# EasyEDA Pro project FPGC-CycloneIV-AIO.eprj, schematic Schematic1, sheets 1 to 3 of 4

## Sheets
1 FPGA: Board Name: Board1; Create Date: 2025-10-27; Page Name: FPGA; Project Name: FPGC-CycloneIV-AIO; Schematic Name: Schematic1; Update Date: 2025-11-22; Company: EasyEDA.com; Page Size: A4; Version: V1.0
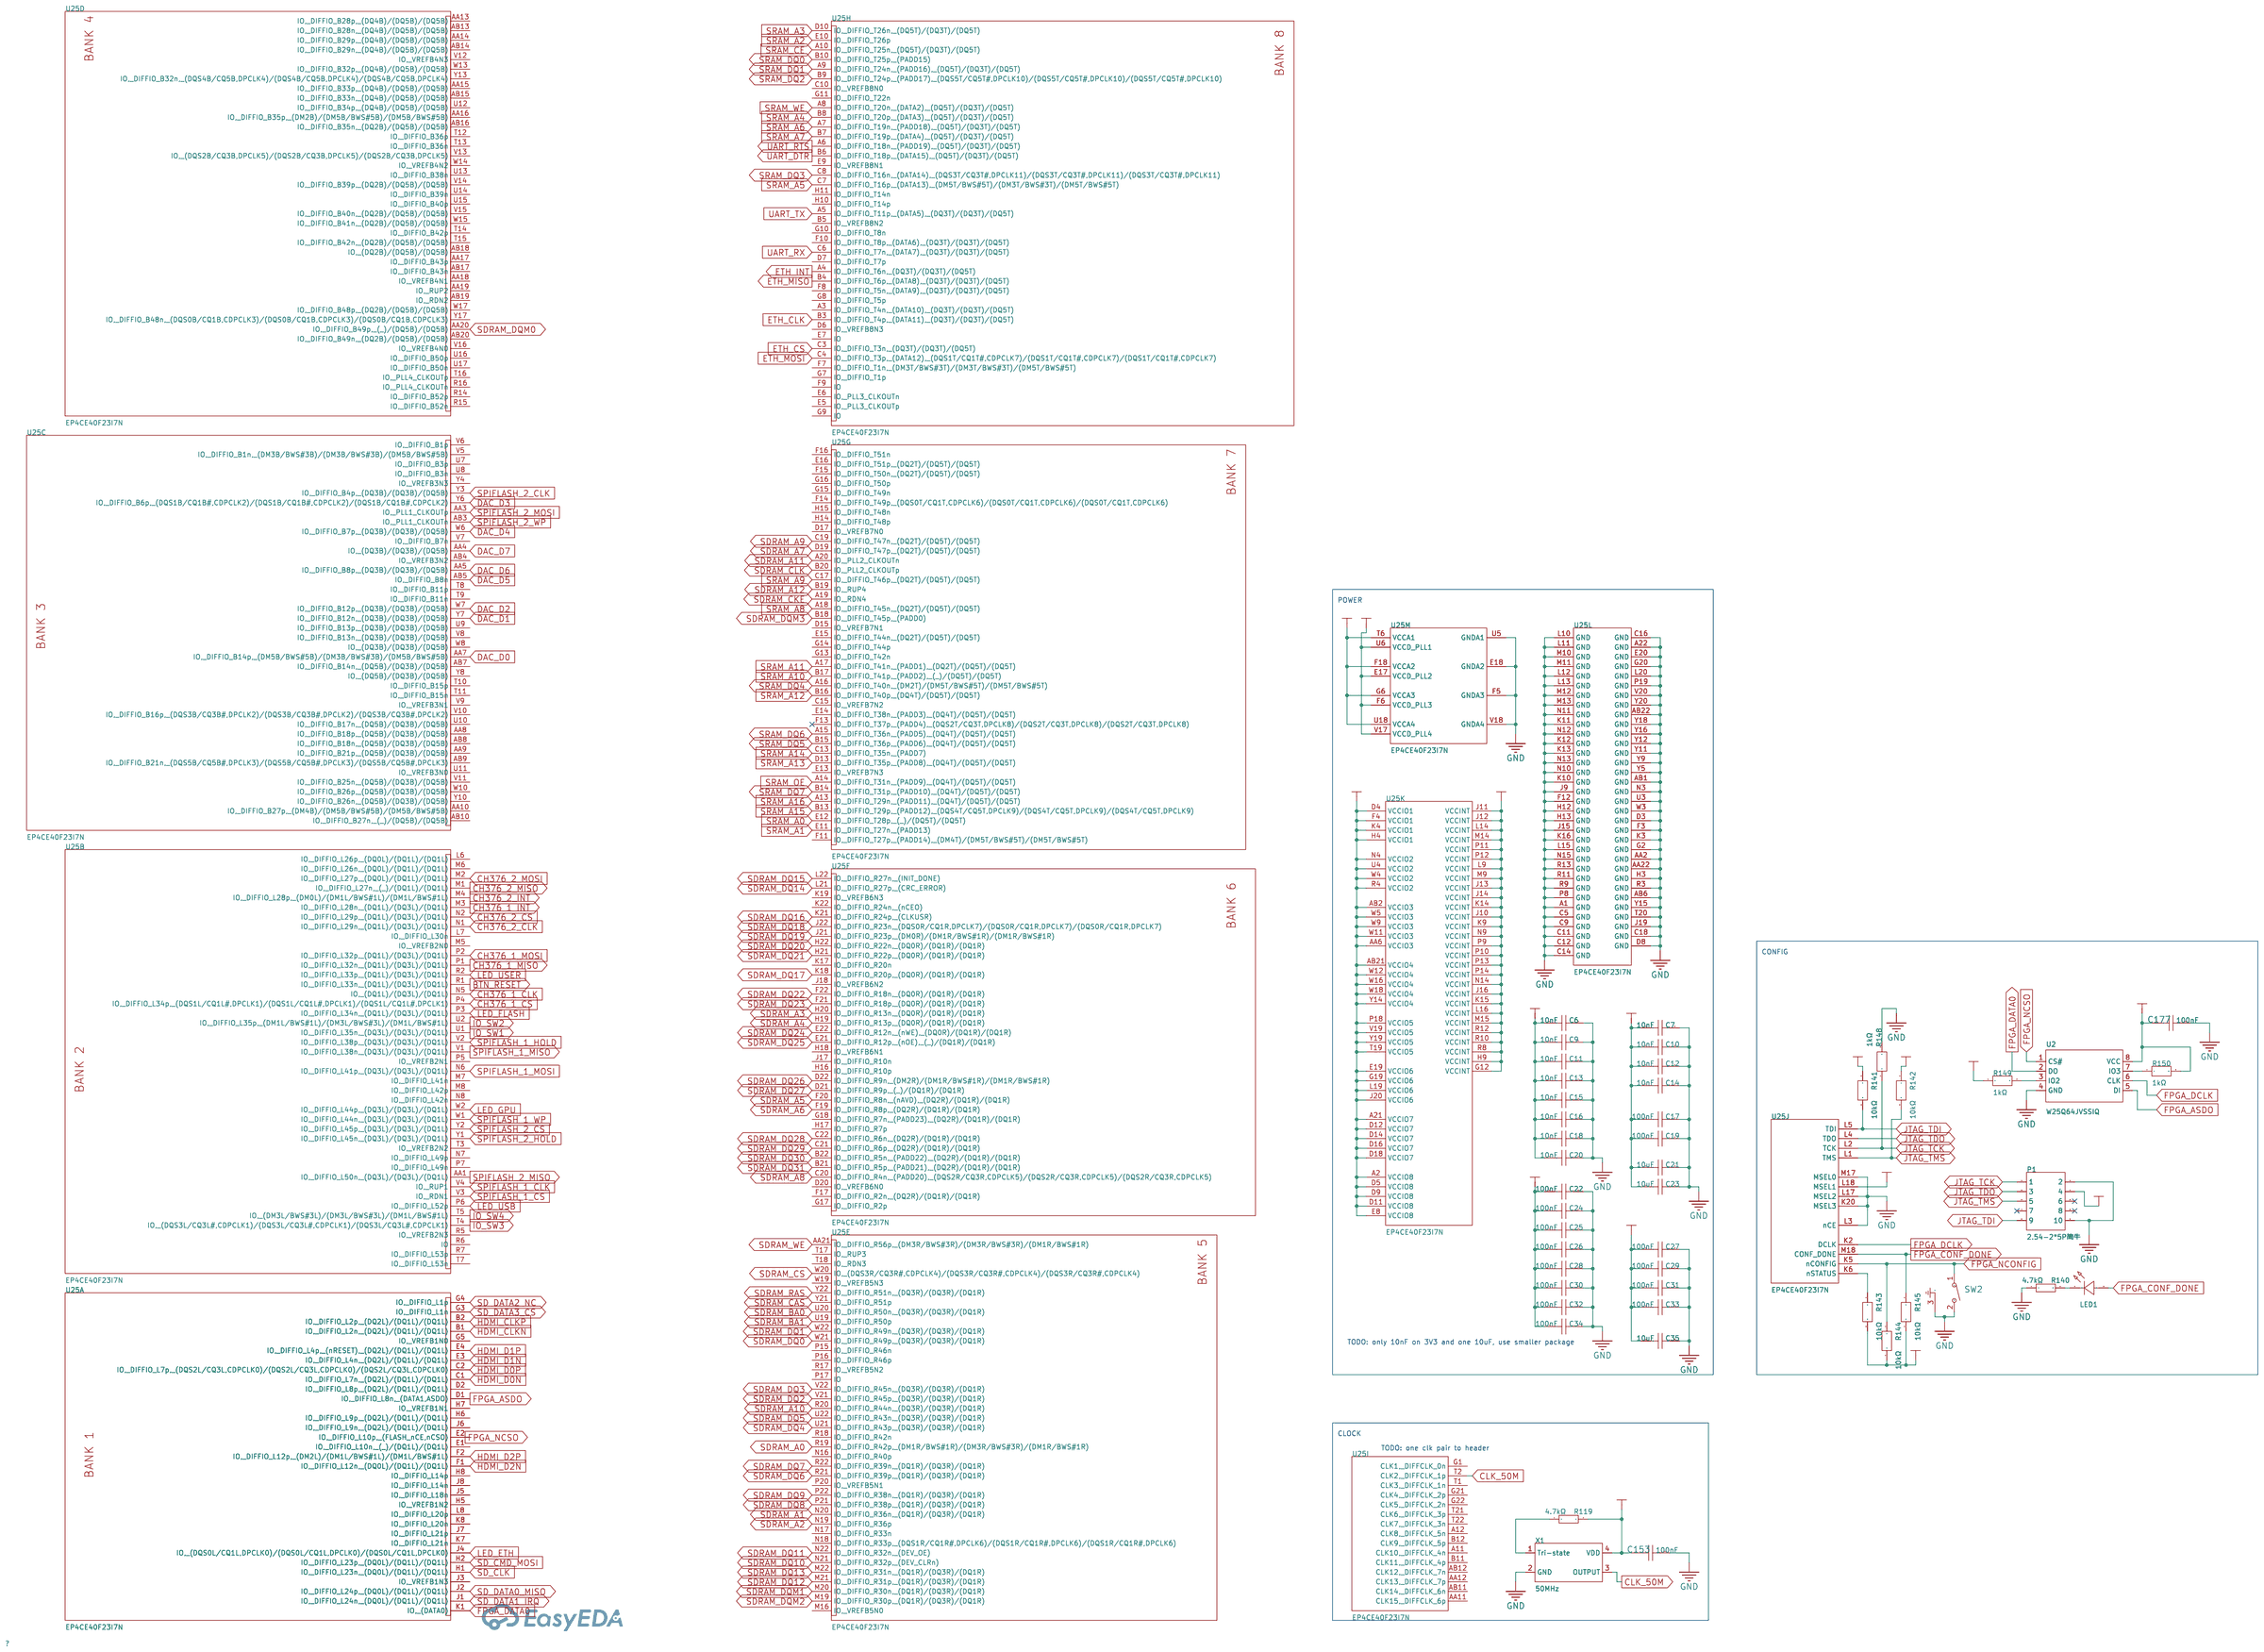
[diagram p0: FPGA]
2 Power: Create Date: 2025-10-28; Page Name: Power; Update Date: 2025-11-03
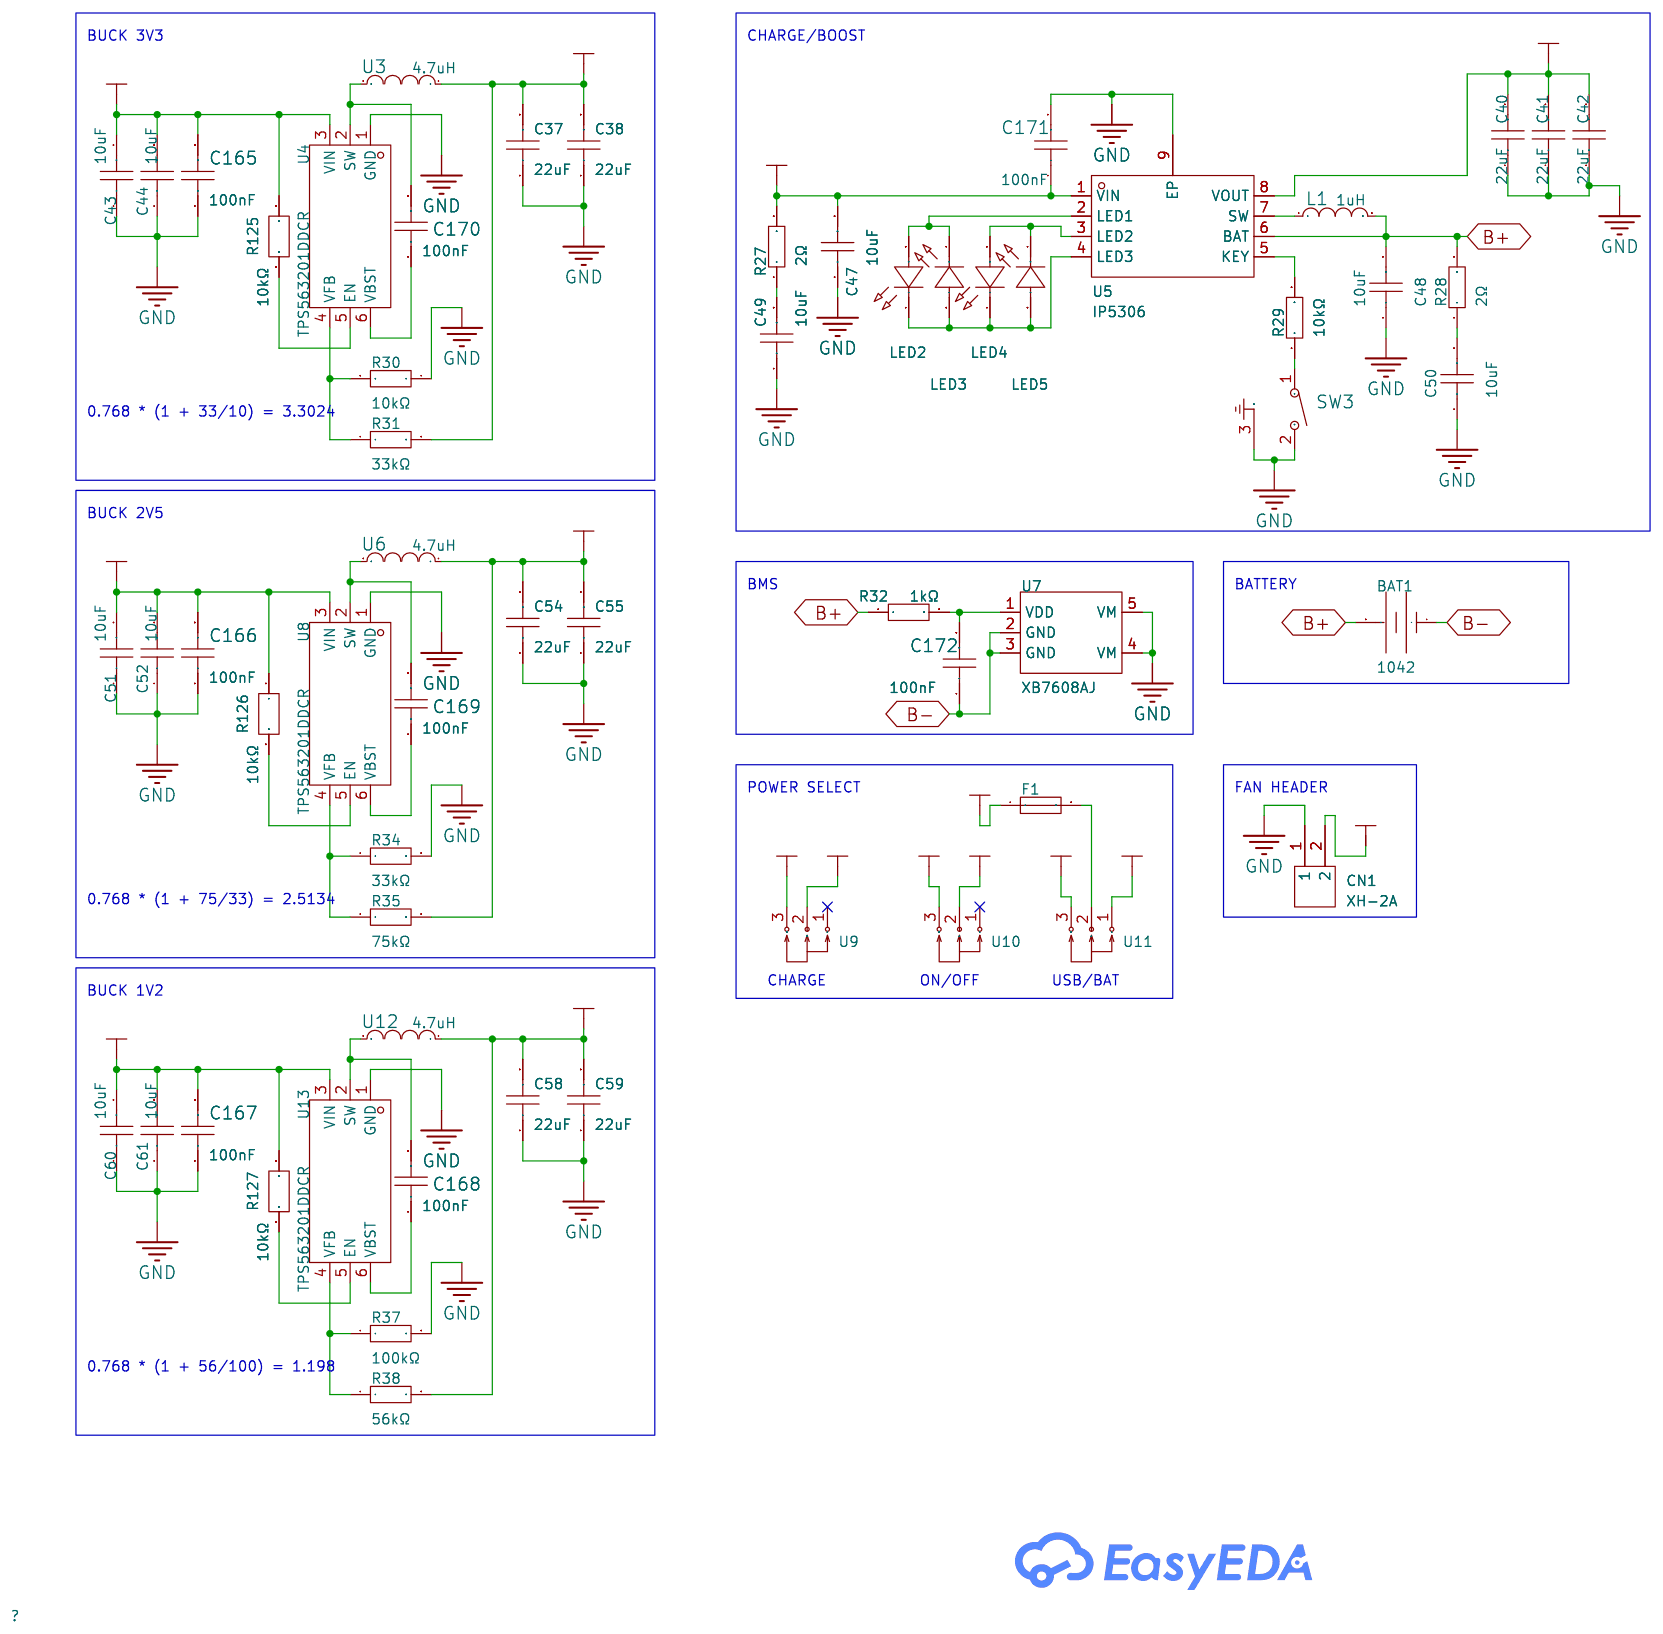
[diagram p1: Power]
3 RAM: Create Date: 2025-10-28; Page Name: RAM; Update Date: 2025-11-15
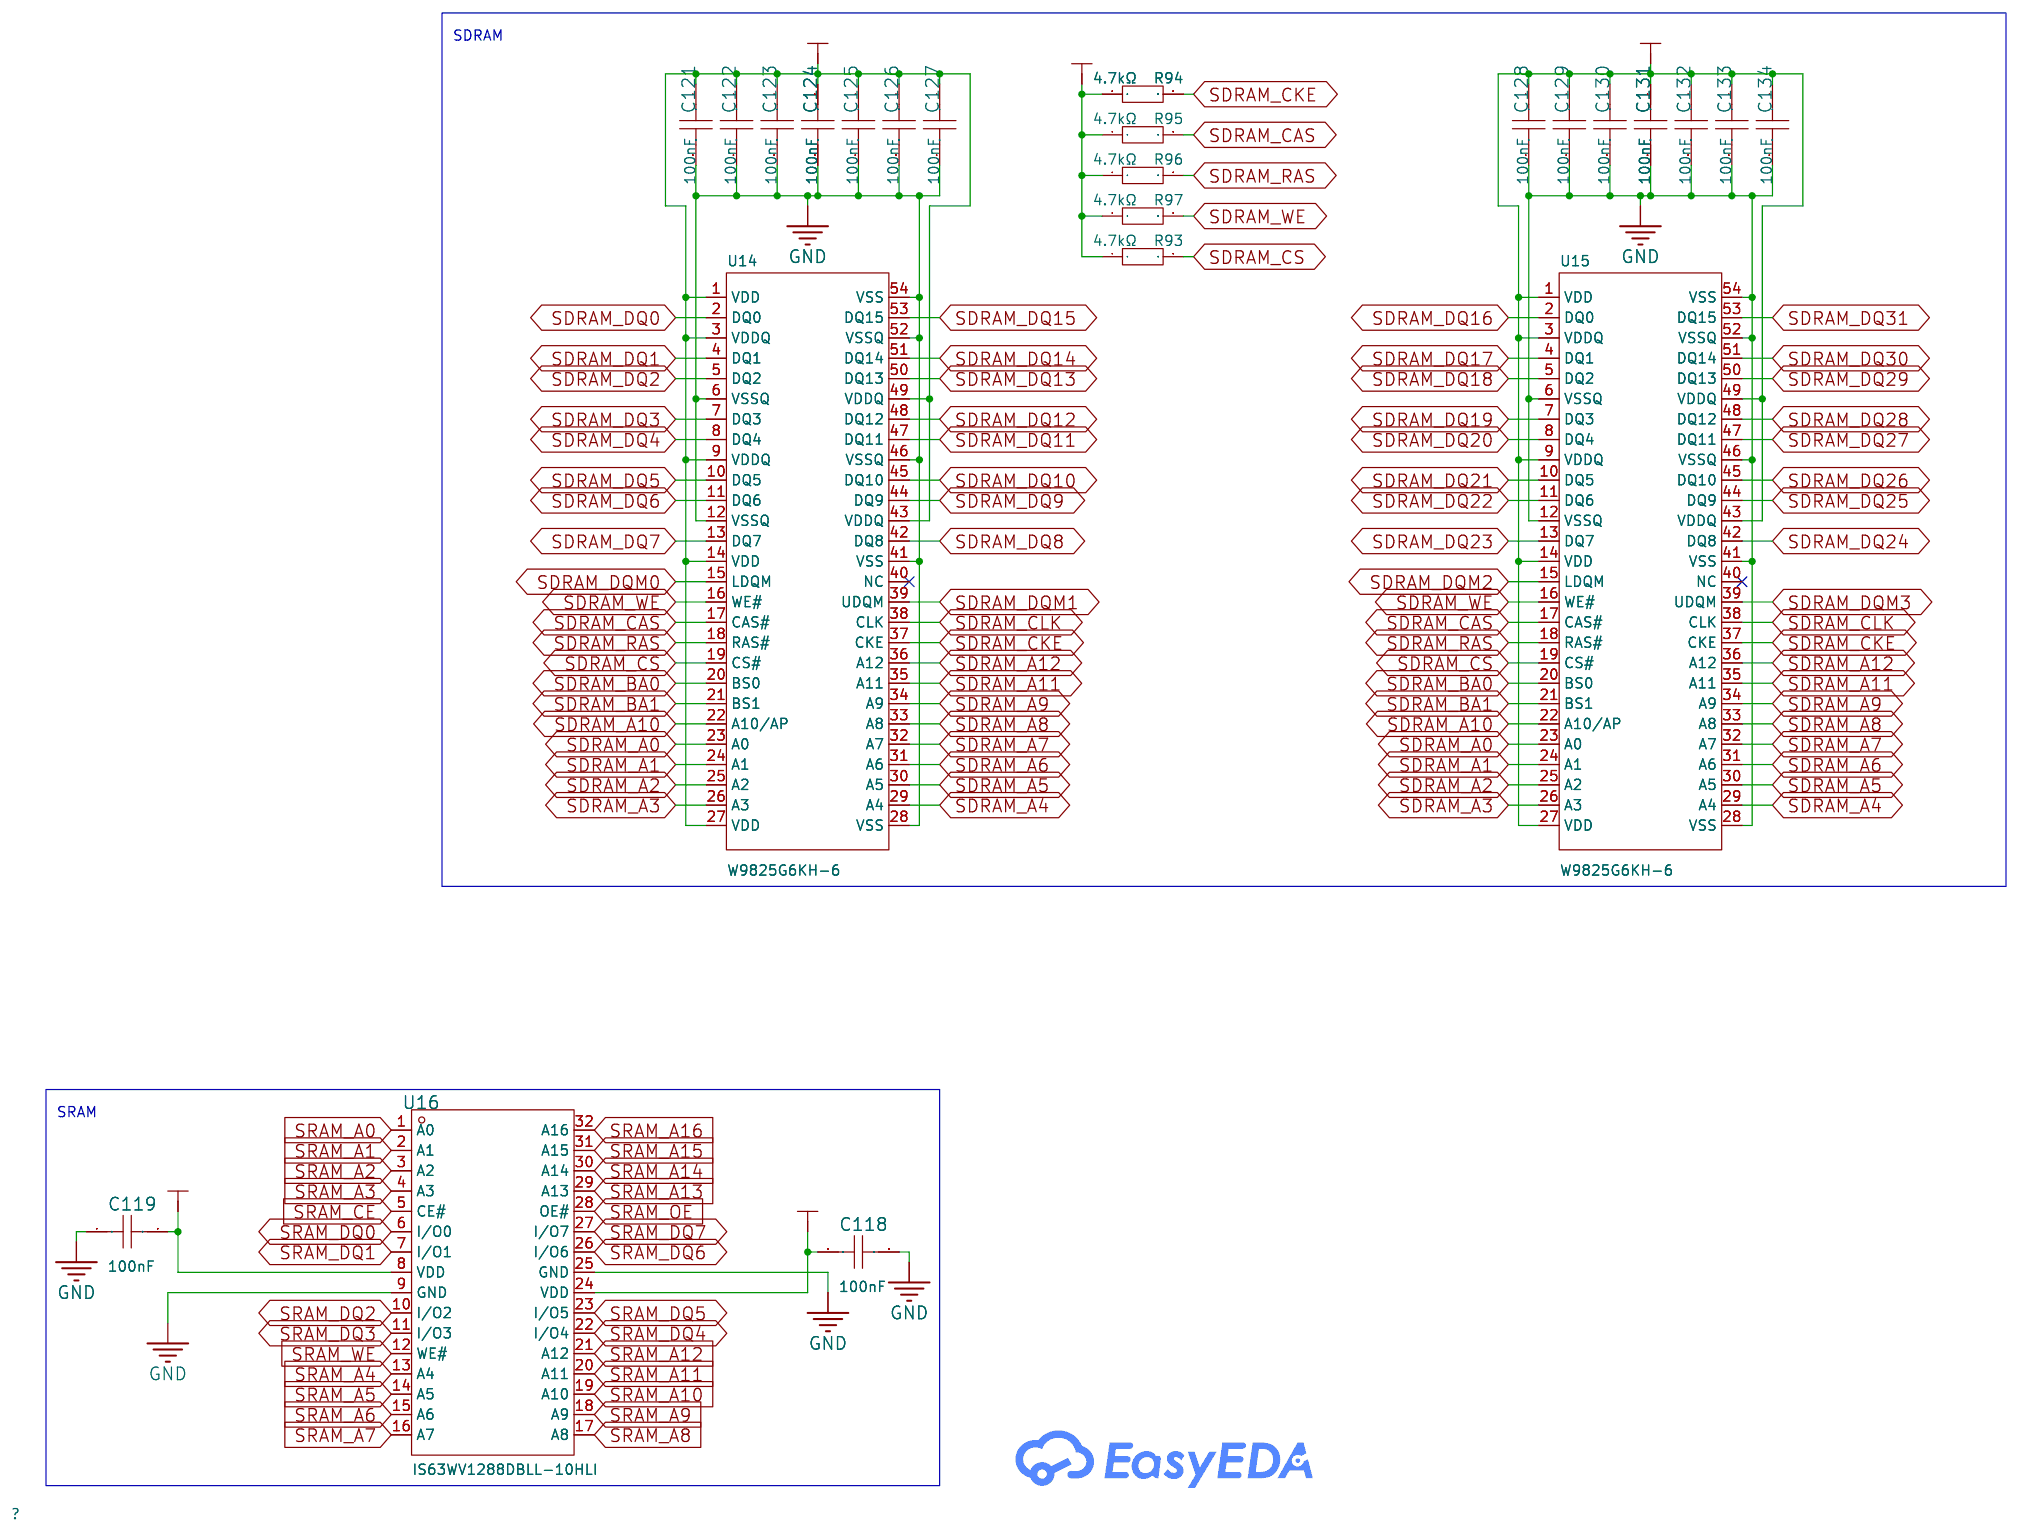
[diagram p2: RAM]

## Parts
sheet FPGA
C6  10nF  [C0805]
C7  10nF  [C0805]
C9  10nF  [C0805]
C10  10nF  [C0805]
C11  10nF  [C0805]
C12  10nF  [C0805]
C13  10nF  [C0805]
C14  10nF  [C0805]
C15  10nF  [C0805]
C16  10nF  [C0805]
C17  100nF  [C0805]
C18  10nF  [C0805]
C19  100nF  [C0805]
C20  10nF  [C0805]
C21  10uF  [C0805]
C22  100nF  [C0805]
C23  10uF  [C0805]
C24  100nF  [C0805]
C25  100nF  [C0805]
C26  100nF  [C0805]
C27  100nF  [C0805]
C28  100nF  [C0805]
C29  100nF  [C0805]
C30  100nF  [C0805]
C31  100nF  [C0805]
C32  100nF  [C0805]
C33  100nF  [C0805]
C34  100nF  [C0805]
C35  10uF  [C0805]
C153  100nF  [C0603]
C177  100nF  [C0603]
LED1  XL-2012SURC  [LED0805-RD_RED]
P1  2.54-2*5P简牛  [IDC-TH_10P-P2.54_C5665]
R119  4.7kΩ  [R0603]
R140  4.7kΩ  [R0603]
R141  10kΩ  [R0603]
R142  10kΩ  [R0603]
R143  10kΩ  [R0603]
R144  10kΩ  [R0603]
R145  10kΩ  [R0603]
R148  1kΩ  [R0603]
R149  1kΩ  [R0603]
R150  1kΩ  [R0603]
SW2  TS-1009B-05026  [SW-TH_3P-L4.5-W3.8-P3.10-LS1.9]
U2  W25Q64JVSSIQ  [SOP-8_L5.3-W5.3-P1.27-LS8.0-BL]
U25  EP4CE40F23I7N  [FBGA-484_L23.0-W23.0-R22-C22-P1.00-TL]  (sections 1,10,11,12,13,2,3,4,5,6,7,8,9)
X1  50MHz  [OSC-SMD_4P-L3.2-W2.5-BL]
sheet Power
BAT1  1042  [BAT-SMD_1042P]
C37  22uF  [C0805]
C38  22uF  [C0805]
C40  22uF  [C0805]
C41  22uF  [C0805]
C42  22uF  [C0805]
C43  10uF  [C0805]
C44  10uF  [C0805]
C47  10uF  [C0805]
C48  10uF  [C0805]
C49  10uF  [C0805]
C50  10uF  [C0805]
C51  10uF  [C0805]
C52  10uF  [C0805]
C54  22uF  [C0805]
C55  22uF  [C0805]
C58  22uF  [C0805]
C59  22uF  [C0805]
C60  10uF  [C0805]
C61  10uF  [C0805]
C165  100nF  [C0603]
C166  100nF  [C0603]
C167  100nF  [C0603]
C168  100nF  [C0603]
C169  100nF  [C0603]
C170  100nF  [C0603]
C171  100nF  [C0603]
C172  100nF  [C0603]
CN1  XH-2A  [CONN-TH_XH-2A]
F1  MF-MSMF110/16-2  [F1812]
L1  1uH  [IND-SMD_L7.2-W6.6_GPSR0730]
LED2  XL-2012SURC  [LED0805-RD_RED]
LED3  XL-2012SURC  [LED0805-RD_RED]
LED4  XL-2012SURC  [LED0805-RD_RED]
LED5  XL-2012SURC  [LED0805-RD_RED]
R27  2Ω  [R0805]
R28  2Ω  [R0805]
R29  10kΩ  [R0805]
R30  10kΩ  [R0805]
R31  33kΩ  [R0805]
R32  1kΩ  [R0805]
R34  33kΩ  [R0805]
R35  75kΩ  [R0805]
R37  100kΩ  [R0805]
R38  56kΩ  [R0805]
R125  10kΩ  [R0603]
R126  10kΩ  [R0603]
R127  10kΩ  [R0603]
SW3  TS-1009B-05026  [SW-TH_3P-L4.5-W3.8-P3.10-LS1.9]
U3  4.7uH  [IND-SMD_L7.2-W6.6_GPSR07X0]
U4  TPS563201DDCR  [SOT-23-6_L2.9-W1.6-P0.95-LS2.8-BR]
U5  IP5306  [ESOP-8_L4.9-W3.9-P1.27-LS6.0-BL-EP]
U6  4.7uH  [IND-SMD_L7.2-W6.6_GPSR07X0]
U7  XB7608AJ  [CPC-5_L2.6-W2.6-P0.53-LS4.0-BL]
U8  TPS563201DDCR  [SOT-23-6_L2.9-W1.6-P0.95-LS2.8-BR]
U9  SS12D10G6-WJ  [SW-TH_3P-P4.80_HX-SS12D10G6-WJ]
U10  SS12D10G6-WJ  [SW-TH_3P-P4.80_HX-SS12D10G6-WJ]
U11  SS12D10G6-WJ  [SW-TH_3P-P4.80_HX-SS12D10G6-WJ]
U12  4.7uH  [IND-SMD_L7.2-W6.6_GPSR07X0]
U13  TPS563201DDCR  [SOT-23-6_L2.9-W1.6-P0.95-LS2.8-BR]
sheet RAM
C118  100nF  [C0603]
C119  100nF  [C0603]
C121  100nF  [C0603]
C122  100nF  [C0603]
C123  100nF  [C0603]
C124  100nF  [C0603]
C125  100nF  [C0603]
C126  100nF  [C0603]
C127  100nF  [C0603]
C128  100nF  [C0603]
C129  100nF  [C0603]
C130  100nF  [C0603]
C131  100nF  [C0603]
C132  100nF  [C0603]
C133  100nF  [C0603]
C134  100nF  [C0603]
R93  4.7kΩ  [R0603]
R94  4.7kΩ  [R0603]
R95  4.7kΩ  [R0603]
R96  4.7kΩ  [R0603]
R97  4.7kΩ  [R0603]
U14  W9825G6KH-6  [TSOP-54_L22.2-W10.2-P0.80-LS11.8-BL]
U15  W9825G6KH-6  [TSOP-54_L22.2-W10.2-P0.80-LS11.8-BL]
U16  IS63WV1288DBLL-10HLI  [TSOPI-32_L18.4-W8.0-P0.50-LS20.0-TL]

## Library data of the parts
C6 C7 C9-C16 C18 C20 = CC0805KRX7R9BB103: LCSC Part Name: 10nF ±10% 50V; Supplier Part: C83170; Manufacturer: YAGEO(国巨); Supplier Footprint: 0805; JLCPCB Part Class: Extended Part; Datasheet: https://item.szlcsc.com/datasheet/CC0805KRX7R9BB103/84334.html; Supplier: LCSC; Tolerance: ±10%; Voltage Rating: 50V; Temperature Coefficient: X7R
C17 C19 C22 C24-C34 = CC0805KRX7R9BB104: LCSC Part Name: 100nF ±10% 50V; Supplier Part: C49678; Manufacturer: YAGEO(国巨); Supplier Footprint: 0805; JLCPCB Part Class: Basic Part; Datasheet: https://item.szlcsc.com/datasheet/CC0805KRX7R9BB104/50686.html; Supplier: LCSC; Tolerance: ±10%; Voltage Rating: 50V; Temperature Coefficient: X7R
C21 C23 C35 C43 C44 C47-C52 C60 C61 = CL21A106KAYNNNE_C15850: LCSC Part Name: 10uF ±10% 25V; Supplier Part: C15850; Manufacturer: SAMSUNG(三星); Manufacturer Part: CL21A106KAYNNNE; Supplier Footprint: 0805; JLCPCB Part Class: Basic Part; Datasheet: https://item.szlcsc.com/datasheet/CL21A106KAYNNNE/16532.html; Supplier: LCSC; Tolerance: ±10%; Voltage Rating: 25V; Temperature Coefficient: X5R
C118 C119 C121-C134 C153 C165-C172 C177 = CL10B104KB8NNNC: LCSC Part Name: 100nF ±10% 50V; Supplier Part: C1591; Manufacturer: SAMSUNG(三星); Supplier Footprint: 0603; JLCPCB Part Class: Extended Part; Datasheet: https://item.szlcsc.com/datasheet/CL10B104KB8NNNC/1943.html; Supplier: LCSC; Tolerance: ±10%; Voltage Rating: 50V; Temperature Coefficient: X7R
LED1-LED5 = XL-2012SURC: Supplier Part: C965812; Manufacturer: XINGLIGHT(成兴光); Supplier Footprint: 0805; JLCPCB Part Class: Extended Part; Datasheet: https://atta.szlcsc.com/upload/public/pdf/source/20221102/49E1A0A365644091E6270AF1C5E0FE37.pdf; Supplier: LCSC; Emitted Color: Red; Power Dissipation: 55mW; Forward Current: 25mA; Dominant Wavelength: 617nm~621nm; Peak Wavelength: 623nm; Lens Color: 无色透明透镜; Viewing Angle: 120°; Mounting Sytle: Positive post; Operating Temperature: -30℃~+85℃
P1 = 2.54-2*5P简牛: LCSC Part Name: 2.54mm 2x5P 排数:2 每排P数:5; Supplier Part: C5665; Manufacturer: BOOMELE(博穆精密); Supplier Footprint: 插件,P=2.54mm; JLCPCB Part Class: Extended Part; Datasheet: https://item.szlcsc.com/datasheet/2.54-2*5P%25E7%25AE%2580%25E7%2589%259B/6118.html; Supplier: LCSC; Connector Type: IDC Header; Pitch: 2.54mm; Number of Positions or Pins: 2x5P; Holder Type: Through Hole; Row Spacing: 2.54mm; Number of Rows: 2; Number of PINs Per Row: 5
R93-R97 R119 R140 = RC0603FR-074K7L: LCSC Part Name: 厚膜电阻 4.7kΩ ±1% 100mW; Supplier Part: C99782; Manufacturer: YAGEO(国巨); Supplier Footprint: 0603; JLCPCB Part Class: Extended Part; Datasheet: https://item.szlcsc.com/datasheet/RC0603FR-074K7L/100996.html; Supplier: LCSC; Type: Thick Film Resistor; Tolerance: ±1%; Power(Watts): 100mW; Voltage-Supply(Max): 75V; Temperature Coefficient: ±100ppm/℃; Operating Temperature: -55℃~+155℃
R125-R127 R141-R145 = FRC0603F1002TS: LCSC Part Name: 10kΩ ±1% 100mW 厚膜电阻; Supplier Part: C2906982; Manufacturer: FOJAN(富捷); Supplier Footprint: 0603; JLCPCB Part Class: Extended Part; Supplier: LCSC; Type: Thick Film Resistor; Tolerance: ±1%; Power(Watts): 100mW; Voltage-Supply(Max): 75V; Temperature Coefficient: ±100ppm/℃; Operating Temperature: -55℃~+155℃
R148-R150 = FRC0603F1001TS: LCSC Part Name: 1kΩ ±1% 100mW 厚膜电阻; Supplier Part: C2907002; Manufacturer: FOJAN(富捷); Supplier Footprint: 0603; JLCPCB Part Class: Extended Part; Supplier: LCSC; Type: Thick Film Resistor; Tolerance: ±1%; Power(Watts): 100mW; Voltage-Supply(Max): 75V; Temperature Coefficient: ±100ppm/℃; Operating Temperature: -55℃~+155℃
SW2 SW3 = TS-1009B-05026: LCSC Part Name: 4.5*4.5*5mm 卧插 轻触开关; Supplier Part: C455252; Manufacturer: XUNPU(讯普); Supplier Footprint: 插件,4.5x4.5mm; JLCPCB Part Class: Extended Part; Datasheet: https://item.szlcsc.com/datasheet/TS-1009B-05026/457607.html; Supplier: LCSC; Circuit: SPST; Actuator Style: Round Button; Mounting Type: Right Angle; Length: 4.5mm; Width: 4.5mm; Switch Height: 5mm; Contact Current: 50mA; Voltage Rating: 12V
U2 = W25Q64JVSSIQ_C83140: LCSC Part Name: 支持双线、四线SPI接口的3V 64Mbit 串行闪存; Supplier Part: C83140; Manufacturer: Winbond(华邦); Supplier Footprint: SOIC-8-208mil; JLCPCB Part Class: Extended Part; Datasheet: https://item.szlcsc.com/datasheet/W25Q64JVSSIQ/84304.html; Supplier: LCSC; Interface: SPI; Memory Size: 64Mbit; Clock Frequency: 133MHz; Voltage - Supply: 2.7V~3.6V; Standby Supply Current: 1uA; Program / Erase Cycles: 100,000 Cycles; Page Programming Time (Tpp): 3ms; Data Retention - TDR (Year): 20 Years; Operating Temperature: -40℃~+85℃
U25 = EP4CE40F23I7N: Supplier Part: C968694; Manufacturer: Intel/Altera; Supplier Footprint: FBGA-484; JLCPCB Part Class: Extended Part; Datasheet: https://item.szlcsc.com/datasheet/EP4CE40F23I7N/1056163.html; Supplier: LCSC; Number of Logic Elements/Blocks: 39600; Logic Array Blocks: 2475; Embedded Block RAM: 1161216bit; Operating Temperature: -40℃~+100℃
X1 = OT322550MJBA4SL: LCSC Part Name: YSO110TR 50MHZ 4P 3225 1.8V-3.3V ±10PPM -40~85℃ (±20PPM) CMOS; Supplier Part: C717684; Manufacturer: YXC(扬兴晶振); Supplier Footprint: SMD3225-4P; JLCPCB Part Class: Extended Part; Datasheet: https://item.szlcsc.com/datasheet/OT322550MJBA4SL/758644.html; Supplier: LCSC; Normal temperature Frequency Tolerance: ±10ppm; Output Type: CMOS; Voltage - Supply: 1.8V~3.3V; Frequency Stability: ±20ppm; Operating Temperature: -40℃~+85℃
BAT1 = 1042: Supplier Part: C5249310; Manufacturer: Keystone; JLCPCB Part Class: Extended Part; Datasheet: https://atta.szlcsc.com/upload/public/pdf/source/20220613/E20FB676785C04F2B410CFDFE9F9681E.pdf; Supplier: LCSC
C37 C38 C40-C42 C54 C55 C58 C59 = CL21A226KOQNNNE: LCSC Part Name: 22uF ±10% 16V; Supplier Part: C296720; Manufacturer: SAMSUNG(三星); Supplier Footprint: 0805; JLCPCB Part Class: Extended Part; Datasheet: https://item.szlcsc.com/datasheet/CL21A226KOQNNNE/280885.html; Supplier: LCSC; Tolerance: ±10%; Voltage Rating: 16V; Temperature Coefficient: X5R
CN1 = XH-2A_C20079: LCSC Part Name: 1x2P 间距:2.5mm 直插 系列:XH; Supplier Part: C20079; Manufacturer: BOOMELE(博穆精密); Supplier Footprint: 插件,P=2.5mm; JLCPCB Part Class: Extended Part; Datasheet: https://item.szlcsc.com/datasheet/XH-2A/20789.html; Supplier: LCSC; Pins Structure: 1x2P; Pitch: 2.5mm; Mounting Type: Through Hole; Reference Series: XH; Number of Pins: 2P; Number of Rows: 1; Number of PINs Per Row: 2
F1 = MF-MSMF110/16-2: LCSC Part Name: 16V 1.1A 1812自恢复; Supplier Part: C210834; Manufacturer: BOURNS; Supplier Footprint: 1812; JLCPCB Part Class: Extended Part; Datasheet: https://item.szlcsc.com/datasheet/MF-MSMF110%252F16-2/211712.html; Supplier: LCSC; Power Dissipation: 800mW; Resistance - Initial (Ri) (Min): 40mΩ; Resistance - Post Trip (R1) (Max): 210mΩ; Operating Temperature: -40℃~+85℃
L1 = CYA0630-1.0UH: LCSC Part Name: 1uH ±20%; Supplier Part: C5189744; Manufacturer: SHOU HAN(首韩); Supplier Footprint: SMD,7.2x6.6mm; JLCPCB Part Class: Extended Part; Datasheet: https://atta.szlcsc.com/upload/public/pdf/source/20221010/BB361918FC2293A10D07F0460E6D4CEC.pdf; Supplier: LCSC; Tolerance: ±20%
R27 R28 = 0805W8F200KT5E: LCSC Part Name: 2Ω ±1% 125mW 厚膜电阻; Supplier Part: C17606; Manufacturer: UNI-ROYAL(厚声); Supplier Footprint: 0805; JLCPCB Part Class: Extended Part; Datasheet: https://item.szlcsc.com/datasheet/0805W8F200KT5E/18294.html; Supplier: LCSC; Type: Thick Film Resistor; Tolerance: ±1%; Power(Watts): 125mW; Voltage-Supply(Max): 150V; Temperature Coefficient: ±200ppm/℃; Operating Temperature: -55℃~+155℃
R29 R30 = RC0805FR-0710KL: LCSC Part Name: 厚膜电阻 10kΩ ±1% 125mW; Supplier Part: C84376; Manufacturer: YAGEO(国巨); Supplier Footprint: 0805; JLCPCB Part Class: Extended Part; Datasheet: https://atta.szlcsc.com/upload/public/pdf/source/20250610/89E4D743C004A82A45145C7A2CC3A578.pdf; Supplier: LCSC; Type: Thick Film Resistor; Tolerance: ±1%; Power(Watts): 125mW; Voltage-Supply(Max): 150V; Temperature Coefficient: ±100ppm/℃; Operating Temperature: -55℃~+155℃
R31 R34 = RC0805FR-0733KL: LCSC Part Name: 厚膜电阻 33kΩ ±1% 125mW; Supplier Part: C141696; Manufacturer: YAGEO(国巨); Supplier Footprint: 0805; JLCPCB Part Class: Extended Part; Datasheet: https://item.szlcsc.com/datasheet/RC0805FR-0733KL/153027.html; Supplier: LCSC; Type: Thick Film Resistor; Tolerance: ±1%; Power(Watts): 125mW; Voltage-Supply(Max): 150V; Temperature Coefficient: ±100ppm/℃; Operating Temperature: -55℃~+155℃
R32 = 0805W8F1001T5E: LCSC Part Name: 1kΩ ±1% 125mW 厚膜电阻; Supplier Part: C17513; Manufacturer: UNI-ROYAL(厚声); Supplier Footprint: 0805; JLCPCB Part Class: Basic Part; Datasheet: https://atta.szlcsc.com/upload/public/pdf/source/20200306/C422600_1E6D84923E4A46A82E41ADD87F860B5C.pdf; Supplier: LCSC; Type: Thick Film Resistors; Tolerance: ±1%; Temperature Coefficient: ±100ppm/℃; Operating Temperature Range: -55℃~+155℃
R35 = 0805W8F7502T5E: LCSC Part Name: 75kΩ ±1% 125mW 厚膜电阻; Supplier Part: C17819; Manufacturer: UNI-ROYAL(厚声); Supplier Footprint: 0805; JLCPCB Part Class: Extended Part; Datasheet: https://item.szlcsc.com/datasheet/0805W8F7502T5E/18507.html; Supplier: LCSC; Type: Thick Film Resistor; Tolerance: ±1%; Power(Watts): 125mW; Voltage-Supply(Max): 150V; Temperature Coefficient: ±100ppm/℃; Operating Temperature: -55℃~+155℃
R37 = RS-05K1003FT: LCSC Part Name: 厚膜电阻 100kΩ ±1% 125mW; Supplier Part: C118847; Manufacturer: FH(风华); Supplier Footprint: 0805; JLCPCB Part Class: Extended Part; Datasheet: https://item.szlcsc.com/datasheet/RS-05K1003FT/120115.html; Supplier: LCSC; Type: Thick Film Resistor; Tolerance: ±1%; Power(Watts): 125mW; Voltage-Supply(Max): 150V; Temperature Coefficient: ±100ppm/℃; Operating Temperature: -55℃~+155℃
R38 = 0805W8F5602T5E: LCSC Part Name: 56kΩ ±1% 125mW 厚膜电阻; Supplier Part: C17756; Manufacturer: UNI-ROYAL(厚声); Supplier Footprint: 0805; JLCPCB Part Class: Extended Part; Datasheet: https://item.szlcsc.com/datasheet/0805W8F5602T5E/18444.html; Supplier: LCSC; Type: Thick Film Resistor; Tolerance: ±1%; Power(Watts): 125mW; Voltage-Supply(Max): 150V; Temperature Coefficient: ±100ppm/℃; Operating Temperature: -55℃~+155℃
U3 U6 U12 = CYA0630-4.7UH: LCSC Part Name: 4.7uH ±20%; Supplier Part: C5189748; Manufacturer: SHOU HAN(首韩); Supplier Footprint: SMD,7.2x6.6mm; JLCPCB Part Class: Extended Part; Datasheet: https://atta.szlcsc.com/upload/public/pdf/source/20221010/79ACBE86DD414F23A670753564343C1B.pdf; Supplier: LCSC; Tolerance: ±20%; DC Resistance (DCR): 34.5mΩ
U4 U8 U13 = TPS563201DDCR: LCSC Part Name: 4.5V至17V输入，3A同步降压电压调节器; Supplier Part: C116592; Manufacturer: TI(德州仪器); Supplier Footprint: SOT-23-THIN-6; JLCPCB Part Class: Extended Part; Datasheet: https://item.szlcsc.com/datasheet/TPS563201DDCR/117846.html; Supplier: LCSC; Function: Step-down type; Output Type: Adjustable; Voltage - Supply: 4.5V~17V; Output Voltage: 768mV~7V; Output Current: 3A; Frequency - Switching: 580kHz; Operating Temperature: -40℃~+125℃@(TJ); Synchronous Rectifier: Yes; Number of Outputs: 1; Topology: Step-down; Switch tube (built-in/external): Built-in
U5 = IP5306: LCSC Part Name: 集成2.1A充电器和2.1A放电器的全集成移动电源系统级芯片; Supplier Part: C181692; Manufacturer: INJOINIC(英集芯); Supplier Footprint: ESOP-8; JLCPCB Part Class: Extended Part; Datasheet: https://item.szlcsc.com/datasheet/IP5306/193089.html; Supplier: LCSC; The Chip Type: Charging IC；Protection IC; Voltage - Supply: 4.65V~5.5V; Charge Current - Max: 2.1A; Charging Saturation Voltage: 4.2V; End-Off Voltage: 3V; Type of Battery: Lithium Battery; Number of Cells: 1; Operating Temperature: 0℃~+70℃; Supply Current (Iq): 100uA; Interface: I2C
U7 = XB7608AJ: LCSC Part Name: 单节锂离子/聚合物电池保护IC; Supplier Part: C2681921; Manufacturer: xysemi(赛芯微); Supplier Footprint: CPC-5; JLCPCB Part Class: Extended Part; Datasheet: https://item.szlcsc.com/datasheet/XB7608AJ/2775921.html; Supplier: LCSC; The Chip Type: Battery Protection IC; Voltage - Supply: 2V~6V; Charging Saturation Voltage: 4.3V; End-Off Voltage: 2.4V; Type of Battery: Lithium-ion/Polymer; Number of Cells: 1; Operating Temperature: -40℃~+85℃; 0V Battery Charge: Support; Supply Current (Iq): 1.6uA
U9-U11 = SS12D10G6-WJ: LCSC Part Name: 两档卧式插件 3脚拨动开关弯插 柄长6.0mm; Supplier Part: C7431059; Manufacturer: SHOU HAN(首韩); Supplier Footprint: 弯插,12.7x6.7mm; JLCPCB Part Class: Extended Part; Datasheet: https://item.szlcsc.com/datasheet/SS12D10G6-WJ/8431411.html; Supplier: LCSC; Circuit: SPDT; Actuator Style: Rectangular Columnar; Termination Style: PC Pin; Length: 12.7mm; Width: 6.7mm; Switch Height: 12.4mm; Mounting Type: Right Angle; Actuator Color: Black; Current Rating: 2A; Voltage Rating: 125V; Life: 3,000 Cycles; Operating Temperature: -25℃~+70℃
U14 U15 = W9825G6KH-6: LCSC Part Name: 4M×4存储体×16位SDRAM; Supplier Part: C62246; Manufacturer: Winbond(华邦); Supplier Footprint: TSOP-54-10.2mm; JLCPCB Part Class: Extended Part; Datasheet: https://item.szlcsc.com/datasheet/W9825G6KH-6/63303.html; Supplier: LCSC; Memory Size: 256Mbit; Clock Frequency: 166MHz; Voltage - Supply: 3V~3.6V; Operating Temperature: 0℃~+70℃
U16 = IS63WV1288DBLL-10HLI: LCSC Part Name: IS63WV1288DBLL 10HLI; Supplier Part: C1350843; Manufacturer: ISSI(美国芯成); Supplier Footprint: TSOPI-32-8.0mm; JLCPCB Part Class: Extended Part; Datasheet: https://item.szlcsc.com/datasheet/IS63WV1288DBLL-10HLI/1441127.html; Supplier: LCSC; Voltage - Supply: 2.4V~3.6V; Write Cycle Time(Tw): 10ns

## Nets
1V2: C7.1 C10.1 C12.1 C14.1 C17.1 C19.1 C21.1 C23.1 C58.2 C59.2 R38.2 U12.1 U25.E17(VCCD_PLL2) U25.F6(VCCD_PLL3) U25.G12(VCCINT) U25.H9(VCCINT) U25.J10(VCCINT) U25.J11(VCCINT) U25.J12(VCCINT) U25.J13(VCCINT) U25.J14(VCCINT) U25.J16(VCCINT) U25.K9(VCCINT) U25.K14(VCCINT) U25.K15(VCCINT) U25.L9(VCCINT) U25.L14(VCCINT) U25.L16(VCCINT) U25.M9(VCCINT) U25.M14(VCCINT) U25.M15(VCCINT) U25.N9(VCCINT) U25.N14(VCCINT) U25.P9(VCCINT) U25.P10(VCCINT) U25.P11(VCCINT) U25.P12(VCCINT) U25.P13(VCCINT) U25.P14(VCCINT) U25.R8(VCCINT) U25.R10(VCCINT) U25.R12(VCCINT) U25.U6(VCCD_PLL1) U25.V17(VCCD_PLL4)
2V5: C27.1 C29.1 C31.1 C33.1 C35.1 C54.2 C55.2 P1.4 R35.2 R141.1 R142.1 U6.1 U25.F18(VCCA2) U25.G6(VCCA3) U25.L18(MSEL1) U25.T6(VCCA1) U25.U18(VCCA4)
3V3: C6.1 C9.1 C11.1 C13.1 C15.1 C16.1 C18.1 C20.1 C22.1 C24.1 C25.1 C26.1 C28.1 C30.1 C32.1 C34.1 C37.2 C38.2 C118.1 C119.2 C121.1 C122.1 C123.1 C124.1 C125.1 C126.1 C127.1 C128.1 C129.1 C130.1 C131.1 C132.1 C133.1 C134.1 C153.1 C177.1 CN1.2 R31.2 R93.1 R94.1 R95.1 R96.1 R97.1 R119.2 R143.2 R144.2 R145.2 R149.1 R150.2 U2.8(VCC) U3.1 U14.1(VDD) U14.3(VDDQ) U14.9(VDDQ) U14.14(VDD) U14.27(VDD) U14.43(VDDQ) U14.49(VDDQ) U15.1(VDD) U15.3(VDDQ) U15.9(VDDQ) U15.14(VDD) U15.27(VDD) U15.43(VDDQ) U15.49(VDDQ) U16.8(VDD) U16.24(VDD) U25.A2(VCCIO8) U25.A21(VCCIO7) U25.AA6(VCCIO3) U25.AB2(VCCIO3) U25.AB21(VCCIO4) U25.D4(VCCIO1) U25.D5(VCCIO8) U25.D9(VCCIO8) U25.D11(VCCIO8) U25.D12(VCCIO7) U25.D14(VCCIO7) U25.D16(VCCIO7) U25.D18(VCCIO7) U25.E8(VCCIO8) U25.E19(VCCIO6) U25.F4(VCCIO1) U25.G19(VCCIO6) U25.H4(VCCIO1) U25.J20(VCCIO6) U25.K4(VCCIO1) U25.L19(VCCIO6) U25.N4(VCCIO2) U25.P18(VCCIO5) U25.R4(VCCIO2) U25.T19(VCCIO5) U25.U4(VCCIO2) U25.V19(VCCIO5) U25.W4(VCCIO2) U25.W5(VCCIO3) U25.W9(VCCIO3) U25.W11(VCCIO3) U25.W12(VCCIO4) U25.W16(VCCIO4) U25.W18(VCCIO4) U25.Y14(VCCIO4) U25.Y19(VCCIO5) X1.4(VDD) ; also on sheet 4
5V: C43.2 C44.2 C51.2 C52.2 C60.2 C61.2 C165.2 C166.2 C167.2 R125.1 R126.1 R127.1 U4.3(VIN) U8.3(VIN) U10.2 U13.3(VIN) ; also on sheet 4
5VIN: C47.2 C171.1 R27.2 U5.1(VIN) U9.2
5VOUT: C40.2 C41.2 C42.2 U5.8(VOUT) U11.1
5VSEL: F1.1 U10.3
GND: C6.2 C7.2 C9.2 C10.2 C11.2 C12.2 C13.2 C14.2 C15.2 C16.2 C17.2 C18.2 C19.2 C20.2 C21.2 C22.2 C23.2 C24.2 C25.2 C26.2 C27.2 C28.2 C29.2 C30.2 C31.2 C32.2 C33.2 C34.2 C35.2 C37.1 C38.1 C40.1 C41.1 C42.1 C43.1 C44.1 C47.1 C48.1 C49.1 C50.1 C51.1 C52.1 C54.1 C55.1 C58.1 C59.1 C60.1 C61.1 C118.2 C119.1 C121.2 C122.2 C123.2 C124.2 C125.2 C126.2 C127.2 C128.2 C129.2 C130.2 C131.2 C132.2 C133.2 C134.2 C153.2 C165.1 C166.1 C167.1 C171.2 C177.2 CN1.1 P1.2 P1.10 R30.1 R34.2 R37.2 R140.1 R148.2 SW2.2 SW2.3 SW3.2 SW3.3 U2.4(GND) U4.1(GND) U5.9(EP) U7.4(VM) U7.5(VM) U8.1(GND) U13.1(GND) U14.6(VSSQ) U14.12(VSSQ) U14.28(VSS) U14.41(VSS) U14.46(VSSQ) U14.52(VSSQ) U14.54(VSS) U15.6(VSSQ) U15.12(VSSQ) U15.28(VSS) U15.41(VSS) U15.46(VSSQ) U15.52(VSSQ) U15.54(VSS) U16.9(GND) U16.25(GND) U25.A1(GND) U25.A22(GND) U25.AA2(GND) U25.AA22(GND) U25.AB1(GND) U25.AB6(GND) U25.AB22(GND) U25.C5(GND) U25.C9(GND) U25.C11(GND) U25.C12(GND) U25.C14(GND) U25.C16(GND) U25.C18(GND) U25.D3(GND) U25.D8(GND) U25.E18(GNDA2) U25.E20(GND) U25.F3(GND) U25.F5(GNDA3) U25.F12(GND) U25.G2(GND) U25.G20(GND) U25.H3(GND) U25.H12(GND) U25.H13(GND) U25.J9(GND) U25.J15(GND) U25.J19(GND) U25.K3(GND) U25.K10(GND) U25.K11(GND) U25.K12(GND) U25.K13(GND) U25.K16(GND) U25.K20(MSEL3) U25.L3(nCE) U25.L10(GND) U25.L11(GND) U25.L12(GND) U25.L13(GND) U25.L15(GND) U25.L17(MSEL2) U25.L20(GND) U25.M10(GND) U25.M11(GND) U25.M12(GND) U25.M13(GND) U25.M17(MSEL0) U25.N3(GND) U25.N10(GND) U25.N11(GND) U25.N12(GND) U25.N13(GND) U25.N15(GND) U25.P8(GND) U25.P19(GND) U25.R3(GND) U25.R9(GND) U25.R11(GND) U25.R13(GND) U25.T20(GND) U25.U3(GND) U25.U5(GNDA1) U25.V18(GNDA4) U25.V20(GND) U25.W3(GND) U25.Y5(GND) U25.Y9(GND) U25.Y11(GND) U25.Y12(GND) U25.Y15(GND) U25.Y16(GND) U25.Y18(GND) U25.Y20(GND) X1.2(GND) ; also on sheet 4
B+: BAT1.2(+) C48.2 L1.2 R28.2 R32.1 U5.6(BAT)
B-: BAT1.1(-) C172.1 U7.2(GND) U7.3(GND)
BTN_RESET: U25.R1(IO, DIFFIO_L33n, (DQ1L)/(DQ3L)/(DQ1L)) ; also on sheet 4
CH376_1_CLK: U25.N5(IO, (DQ1L)/(DQ3L)/(DQ1L)) ; also on sheet 4
CH376_1_CS: U25.P4(IO, DIFFIO_L34p, (DQS1L/CQ1L#,DPCLK1)/(DQS1L/CQ1L#,DPCLK1)/(DQS1L/CQ1L#,DPCLK1)) ; also on sheet 4
CH376_1_INT: U25.M3(IO, DIFFIO_L28n, (DQ1L)/(DQ3L)/(DQ1L)) ; also on sheet 4
CH376_1_MISO: U25.P1(IO, DIFFIO_L32n, (DQ1L)/(DQ3L)/(DQ1L)) ; also on sheet 4
CH376_1_MOSI: U25.P2(IO, DIFFIO_L32p, (DQ1L)/(DQ3L)/(DQ1L)) ; also on sheet 4
CH376_2_CLK: U25.N1(IO, DIFFIO_L29n, (DQ1L)/(DQ3L)/(DQ1L)) ; also on sheet 4
CH376_2_CS: U25.N2(IO, DIFFIO_L29p, (DQ1L)/(DQ3L)/(DQ1L)) ; also on sheet 4
CH376_2_INT: U25.M4(IO, DIFFIO_L28p, (DM0L)/(DM1L/BWS#1L)/(DM1L/BWS#1L)) ; also on sheet 4
CH376_2_MISO: U25.M1(IO, DIFFIO_L27n, (_)/(DQ1L)/(DQ1L)) ; also on sheet 4
CH376_2_MOSI: U25.M2(IO, DIFFIO_L27p, (DQ0L)/(DQ1L)/(DQ1L)) ; also on sheet 4
CLK_50M: U25.T2(CLK2, DIFFCLK_1p) X1.3(OUTPUT)
DAC_D0: U25.AA7(IO, DIFFIO_B14p, (DM5B/BWS#5B)/(DM3B/BWS#3B)/(DM5B/BWS#5B)) ; also on sheet 4
DAC_D1: U25.Y7(IO, DIFFIO_B12n, (DQ3B)/(DQ3B)/(DQ5B)) ; also on sheet 4
DAC_D2: U25.W7(IO, DIFFIO_B12p, (DQ3B)/(DQ3B)/(DQ5B)) ; also on sheet 4
DAC_D3: U25.Y6(IO, DIFFIO_B6p, (DQS1B/CQ1B#,CDPCLK2)/(DQS1B/CQ1B#,CDPCLK2)/(DQS1B/CQ1B#,CDPCLK2)) ; also on sheet 4
DAC_D4: U25.W6(IO, DIFFIO_B7p, (DQ3B)/(DQ3B)/(DQ5B)) ; also on sheet 4
DAC_D5: U25.AB5(IO, DIFFIO_B8n) ; also on sheet 4
DAC_D6: U25.AA5(IO, DIFFIO_B8p, (DQ3B)/(DQ3B)/(DQ5B)) ; also on sheet 4
DAC_D7: U25.AA4(IO, (DQ3B)/(DQ3B)/(DQ5B)) ; also on sheet 4
ETH_CLK: U25.B3(IO, DIFFIO_T4p, (DATA11), (DQ3T)/(DQ3T)/(DQ5T)) ; also on sheet 4
ETH_CS: U25.C3(IO, DIFFIO_T3n, (DQ3T)/(DQ3T)/(DQ5T)) ; also on sheet 4
ETH_INT: U25.A4(IO, DIFFIO_T6n, (DQ3T)/(DQ3T)/(DQ5T)) ; also on sheet 4
ETH_MISO: U25.B4(IO, DIFFIO_T6p, (DATA8), (DQ3T)/(DQ3T)/(DQ5T)) ; also on sheet 4
ETH_MOSI: U25.C4(IO, DIFFIO_T3p, (DATA12), (DQS1T/CQ1T#,CDPCLK7)/(DQS1T/CQ1T#,CDPCLK7)/(DQS1T/CQ1T#,CDPCLK7)) ; also on sheet 4
FPGA_ASDO: U2.5(DI) U25.D1(IO, DIFFIO_L8n, (DATA1,ASDO))
FPGA_CONF_DONE: LED1.2(A) R145.1 U25.M18(CONF_DONE)
FPGA_DATA0: U2.2(DO) U25.K1(IO, (DATA0))
FPGA_DCLK: U2.6(CLK) U25.K2(DCLK)
FPGA_NCONFIG: R144.1 SW2.1 U25.K5(nCONFIG)
FPGA_NCSO: U2.1(CS#) U25.E2(IO, DIFFIO_L10p, (FLASH_nCE,nCSO))
HDMI_CLKN: U25.B1(IO, DIFFIO_L2n, (DQ2L)/(DQ1L)/(DQ1L)) ; also on sheet 4
HDMI_CLKP: U25.B2(IO, DIFFIO_L2p, (DQ2L)/(DQ1L)/(DQ1L)) ; also on sheet 4
HDMI_D0N: U25.C1(IO, DIFFIO_L7n, (DQ2L)/(DQ1L)/(DQ1L)) ; also on sheet 4
HDMI_D0P: U25.C2(IO, DIFFIO_L7p, (DQS2L/CQ3L,CDPCLK0)/(DQS2L/CQ3L,CDPCLK0)/(DQS2L/CQ3L,CDPCLK0)) ; also on sheet 4
HDMI_D1N: U25.E3(IO, DIFFIO_L4n, (DQ2L)/(DQ1L)/(DQ1L)) ; also on sheet 4
HDMI_D1P: U25.E4(IO, DIFFIO_L4p, (nRESET), (DQ2L)/(DQ1L)/(DQ1L)) ; also on sheet 4
HDMI_D2N: U25.F1(IO, DIFFIO_L12n, (DQ0L)/(DQ1L)/(DQ1L)) ; also on sheet 4
HDMI_D2P: U25.F2(IO, DIFFIO_L12p, (DM2L)/(DM1L/BWS#1L)/(DM1L/BWS#1L)) ; also on sheet 4
IO_SW1: U25.U1(IO, DIFFIO_L35n, (DQ3L)/(DQ3L)/(DQ1L)) ; also on sheet 4
IO_SW2: U25.U2(IO, DIFFIO_L35p, (DM1L/BWS#1L)/(DM3L/BWS#3L)/(DM1L/BWS#1L)) ; also on sheet 4
IO_SW3: U25.T4(IO, (DQS3L/CQ3L#,CDPCLK1)/(DQS3L/CQ3L#,CDPCLK1)/(DQS3L/CQ3L#,CDPCLK1)) ; also on sheet 4
IO_SW4: U25.T5(IO, (DM3L/BWS#3L)/(DM3L/BWS#3L)/(DM1L/BWS#1L)) ; also on sheet 4
JTAG_TCK: P1.1 R148.1 U25.L2(TCK)
JTAG_TDI: P1.9 R141.2 U25.L5(TDI)
JTAG_TDO: P1.3 U25.L4(TDO)
JTAG_TMS: P1.5 R142.2 U25.L1(TMS)
LED_ETH: U25.J4(IO, (DQS0L/CQ1L,DPCLK0)/(DQS0L/CQ1L,DPCLK0)/(DQS0L/CQ1L,DPCLK0)) ; also on sheet 4
LED_FLASH: U25.P3(IO, DIFFIO_L34n, (DQ1L)/(DQ3L)/(DQ1L)) ; also on sheet 4
LED_GPU: U25.W2(IO, DIFFIO_L44p, (DQ3L)/(DQ3L)/(DQ1L)) ; also on sheet 4
LED_USB: U25.P6(IO, DIFFIO_L52p) ; also on sheet 4
LED_USER: U25.R2(IO, DIFFIO_L33p, (DQ1L)/(DQ3L)/(DQ1L)) ; also on sheet 4
SD_CLK: U25.H1(IO, DIFFIO_L23n, (DQ0L)/(DQ1L)/(DQ1L)) ; also on sheet 4
SD_CMD_MOSI: U25.H2(IO, DIFFIO_L23p, (DQ0L)/(DQ1L)/(DQ1L)) ; also on sheet 4
SD_DATA0_MISO: U25.J2(IO, DIFFIO_L24p, (DQ0L)/(DQ1L)/(DQ1L)) ; also on sheet 4
SD_DATA1_IRQ: U25.J1(IO, DIFFIO_L24n, (DQ0L)/(DQ1L)/(DQ1L)) ; also on sheet 4
SD_DATA2_NC: U25.G4(IO, DIFFIO_L1p) ; also on sheet 4
SD_DATA3_CS: U25.G3(IO, DIFFIO_L1n) ; also on sheet 4
SDRAM_A0: U14.23(A0) U15.23(A0) U25.R19(IO, DIFFIO_R42p, (DM1R/BWS#1R)/(DM3R/BWS#3R)/(DM1R/BWS#1R))
SDRAM_A1: U14.24(A1) U15.24(A1) U25.N20(IO, DIFFIO_R36n, (DQ1R)/(DQ3R)/(DQ1R))
SDRAM_A2: U14.25(A2) U15.25(A2) U25.N19(IO, DIFFIO_R36p)
SDRAM_A3: U14.26(A3) U15.26(A3) U25.H20(IO, DIFFIO_R13n, (DQ0R)/(DQ1R)/(DQ1R))
SDRAM_A4: U14.29(A4) U15.29(A4) U25.H19(IO, DIFFIO_R13p, (DQ0R)/(DQ1R)/(DQ1R))
SDRAM_A5: U14.30(A5) U15.30(A5) U25.F20(IO, DIFFIO_R8n, (nAVD), (DQ2R)/(DQ1R)/(DQ1R))
SDRAM_A6: U14.31(A6) U15.31(A6) U25.F19(IO, DIFFIO_R8p, (DQ2R)/(DQ1R)/(DQ1R))
SDRAM_A7: U14.32(A7) U15.32(A7) U25.D19(IO, DIFFIO_T47p, (DQ2T)/(DQ5T)/(DQ5T))
SDRAM_A8: U14.33(A8) U15.33(A8) U25.C20(IO, DIFFIO_R4n, (PADD20), (DQS2R/CQ3R,CDPCLK5)/(DQS2R/CQ3R,CDPCLK5)/(DQS2R/CQ3R,CDPCLK5))
SDRAM_A9: U14.34(A9) U15.34(A9) U25.C19(IO, DIFFIO_T47n, (DQ2T)/(DQ5T)/(DQ5T))
SDRAM_A10: U14.22(A10/AP) U15.22(A10/AP) U25.R20(IO, DIFFIO_R44n, (DQ3R)/(DQ3R)/(DQ1R))
SDRAM_A11: U14.35(A11) U15.35(A11) U25.A20(IO, PLL2_CLKOUTn)
SDRAM_A12: U14.36(A12) U15.36(A12) U25.B19(IO, RUP4)
SDRAM_BA0: U14.20(BS0) U15.20(BS0) U25.U20(IO, DIFFIO_R50n, (DQ3R)/(DQ3R)/(DQ1R))
SDRAM_BA1: U14.21(BS1) U15.21(BS1) U25.U19(IO, DIFFIO_R50p)
SDRAM_CAS: R95.2 U14.17(CAS#) U15.17(CAS#) U25.Y21(IO, DIFFIO_R51p)
SDRAM_CKE: R94.2 U14.37(CKE) U15.37(CKE) U25.A19(IO, RDN4)
SDRAM_CLK: U14.38(CLK) U15.38(CLK) U25.B20(IO, PLL2_CLKOUTp)
SDRAM_CS: R93.2 U14.19(CS#) U15.19(CS#) U25.W20(IO, (DQS3R/CQ3R#,CDPCLK4)/(DQS3R/CQ3R#,CDPCLK4)/(DQS3R/CQ3R#,CDPCLK4))
SDRAM_DQ0: U14.2(DQ0) U25.W21(IO, DIFFIO_R49p, (DQ3R)/(DQ3R)/(DQ1R))
SDRAM_DQ1: U14.4(DQ1) U25.W22(IO, DIFFIO_R49n, (DQ3R)/(DQ3R)/(DQ1R))
SDRAM_DQ2: U14.5(DQ2) U25.V21(IO, DIFFIO_R45p, (DQ3R)/(DQ3R)/(DQ1R))
SDRAM_DQ3: U14.7(DQ3) U25.V22(IO, DIFFIO_R45n, (DQ3R)/(DQ3R)/(DQ1R))
SDRAM_DQ4: U14.8(DQ4) U25.U21(IO, DIFFIO_R43p, (DQ3R)/(DQ3R)/(DQ1R))
SDRAM_DQ5: U14.10(DQ5) U25.U22(IO, DIFFIO_R43n, (DQ3R)/(DQ3R)/(DQ1R))
SDRAM_DQ6: U14.11(DQ6) U25.R21(IO, DIFFIO_R39p, (DQ1R)/(DQ3R)/(DQ1R))
SDRAM_DQ7: U14.13(DQ7) U25.R22(IO, DIFFIO_R39n, (DQ1R)/(DQ3R)/(DQ1R))
SDRAM_DQ8: U14.42(DQ8) U25.P21(IO, DIFFIO_R38p, (DQ1R)/(DQ3R)/(DQ1R))
SDRAM_DQ9: U14.44(DQ9) U25.P22(IO, DIFFIO_R38n, (DQ1R)/(DQ3R)/(DQ1R))
SDRAM_DQ10: U14.45(DQ10) U25.N21(IO, DIFFIO_R32p, (DEV_CLRn))
SDRAM_DQ11: U14.47(DQ11) U25.N22(IO, DIFFIO_R32n, (DEV_OE))
SDRAM_DQ12: U14.48(DQ12) U25.M21(IO, DIFFIO_R31p, (DQ1R)/(DQ3R)/(DQ1R))
SDRAM_DQ13: U14.50(DQ13) U25.M22(IO, DIFFIO_R31n, (DQ1R)/(DQ3R)/(DQ1R))
SDRAM_DQ14: U14.51(DQ14) U25.L21(IO, DIFFIO_R27p, (CRC_ERROR))
SDRAM_DQ15: U14.53(DQ15) U25.L22(IO, DIFFIO_R27n, (INIT_DONE))
SDRAM_DQ16: U15.2(DQ0) U25.K21(IO, DIFFIO_R24p, (CLKUSR))
SDRAM_DQ17: U15.4(DQ1) U25.K18(IO, DIFFIO_R20p, (DQ0R)/(DQ1R)/(DQ1R))
SDRAM_DQ18: U15.5(DQ2) U25.J22(IO, DIFFIO_R23n, (DQS0R/CQ1R,DPCLK7)/(DQS0R/CQ1R,DPCLK7)/(DQS0R/CQ1R,DPCLK7))
SDRAM_DQ19: U15.7(DQ3) U25.J21(IO, DIFFIO_R23p, (DM0R)/(DM1R/BWS#1R)/(DM1R/BWS#1R))
SDRAM_DQ20: U15.8(DQ4) U25.H22(IO, DIFFIO_R22n, (DQ0R)/(DQ1R)/(DQ1R))
SDRAM_DQ21: U15.10(DQ5) U25.H21(IO, DIFFIO_R22p, (DQ0R)/(DQ1R)/(DQ1R))
SDRAM_DQ22: U15.11(DQ6) U25.F22(IO, DIFFIO_R18n, (DQ0R)/(DQ1R)/(DQ1R))
SDRAM_DQ23: U15.13(DQ7) U25.F21(IO, DIFFIO_R18p, (DQ0R)/(DQ1R)/(DQ1R))
SDRAM_DQ24: U15.42(DQ8) U25.E22(IO, DIFFIO_R12n, (nWE), (DQ0R)/(DQ1R)/(DQ1R))
SDRAM_DQ25: U15.44(DQ9) U25.E21(IO, DIFFIO_R12p, (nOE), (_)/(DQ1R)/(DQ1R))
SDRAM_DQ26: U15.45(DQ10) U25.D22(IO, DIFFIO_R9n, (DM2R)/(DM1R/BWS#1R)/(DM1R/BWS#1R))
SDRAM_DQ27: U15.47(DQ11) U25.D21(IO, DIFFIO_R9p, (_)/(DQ1R)/(DQ1R))
SDRAM_DQ28: U15.48(DQ12) U25.C22(IO, DIFFIO_R6n, (DQ2R)/(DQ1R)/(DQ1R))
SDRAM_DQ29: U15.50(DQ13) U25.C21(IO, DIFFIO_R6p, (DQ2R)/(DQ1R)/(DQ1R))
SDRAM_DQ30: U15.51(DQ14) U25.B22(IO, DIFFIO_R5n, (PADD22), (DQ2R)/(DQ1R)/(DQ1R))
SDRAM_DQ31: U15.53(DQ15) U25.B21(IO, DIFFIO_R5p, (PADD21), (DQ2R)/(DQ1R)/(DQ1R))
SDRAM_DQM0: U14.15(LDQM) U25.AA20(IO, DIFFIO_B49p, (_)/(DQ5B)/(DQ5B))
SDRAM_DQM1: U14.39(UDQM) U25.M20(IO, DIFFIO_R30n, (DQ1R)/(DQ3R)/(DQ1R))
SDRAM_DQM2: U15.15(LDQM) U25.M19(IO, DIFFIO_R30p, (DQ1R)/(DQ3R)/(DQ1R))
SDRAM_DQM3: U15.39(UDQM) U25.B18(IO, DIFFIO_T45p, (PADD0))
SDRAM_RAS: R96.2 U14.18(RAS#) U15.18(RAS#) U25.Y22(IO, DIFFIO_R51n, (DQ3R)/(DQ3R)/(DQ1R))
SDRAM_WE: R97.2 U14.16(WE#) U15.16(WE#) U25.AA21(IO, DIFFIO_R56p, (DM3R/BWS#3R)/(DM3R/BWS#3R)/(DM1R/BWS#1R))
SPIFLASH_1_CLK: U25.V4(IO, RUP1) ; also on sheet 4
SPIFLASH_1_CS: U25.V3(IO, RDN1) ; also on sheet 4
SPIFLASH_1_HOLD: U25.V2(IO, DIFFIO_L38p, (DQ3L)/(DQ3L)/(DQ1L)) ; also on sheet 4
SPIFLASH_1_MISO: U25.V1(IO, DIFFIO_L38n, (DQ3L)/(DQ3L)/(DQ1L)) ; also on sheet 4
SPIFLASH_1_MOSI: U25.N6(IO, DIFFIO_L41p, (DQ3L)/(DQ3L)/(DQ1L)) ; also on sheet 4
SPIFLASH_1_WP: U25.W1(IO, DIFFIO_L44n, (DQ3L)/(DQ3L)/(DQ1L)) ; also on sheet 4
SPIFLASH_2_CLK: U25.Y3(IO, DIFFIO_B4p, (DQ3B)/(DQ3B)/(DQ5B)) ; also on sheet 4
SPIFLASH_2_CS: U25.Y2(IO, DIFFIO_L45p, (DQ3L)/(DQ3L)/(DQ1L)) ; also on sheet 4
SPIFLASH_2_HOLD: U25.Y1(IO, DIFFIO_L45n, (DQ3L)/(DQ3L)/(DQ1L)) ; also on sheet 4
SPIFLASH_2_MISO: U25.AA1(IO, DIFFIO_L50n, (DQ3L)/(DQ3L)/(DQ1L)) ; also on sheet 4
SPIFLASH_2_MOSI: U25.AA3(IO, PLL1_CLKOUTp) ; also on sheet 4
SPIFLASH_2_WP: U25.AB3(IO, PLL1_CLKOUTn) ; also on sheet 4
SRAM_A0: U16.1(A0) U25.E12(IO, DIFFIO_T28p, (_)/(DQ5T)/(DQ5T))
SRAM_A1: U16.2(A1) U25.E11(IO, DIFFIO_T27n, (PADD13))
SRAM_A2: U16.3(A2) U25.E10(IO, DIFFIO_T26p)
SRAM_A3: U16.4(A3) U25.D10(IO, DIFFIO_T26n, (DQ5T)/(DQ3T)/(DQ5T))
SRAM_A4: U16.13(A4) U25.B8(IO, DIFFIO_T20p, (DATA3), (DQ5T)/(DQ3T)/(DQ5T))
SRAM_A5: U16.14(A5) U25.C7(IO, DIFFIO_T16p, (DATA13), (DM5T/BWS#5T)/(DM3T/BWS#3T)/(DM5T/BWS#5T))
SRAM_A6: U16.15(A6) U25.A7(IO, DIFFIO_T19n, (PADD18), (DQ5T)/(DQ3T)/(DQ5T))
SRAM_A7: U16.16(A7) U25.B7(IO, DIFFIO_T19p, (DATA4), (DQ5T)/(DQ3T)/(DQ5T))
SRAM_A8: U16.17(A8) U25.A18(IO, DIFFIO_T45n, (DQ2T)/(DQ5T)/(DQ5T))
SRAM_A9: U16.18(A9) U25.C17(IO, DIFFIO_T46p, (DQ2T)/(DQ5T)/(DQ5T))
SRAM_A10: U16.19(A10) U25.B17(IO, DIFFIO_T41p, (PADD2), (_)/(DQ5T)/(DQ5T))
SRAM_A11: U16.20(A11) U25.A17(IO, DIFFIO_T41n, (PADD1), (DQ2T)/(DQ5T)/(DQ5T))
SRAM_A12: U16.21(A12) U25.B16(IO, DIFFIO_T40p, (DQ4T)/(DQ5T)/(DQ5T))
SRAM_A13: U16.29(A13) U25.D13(IO, DIFFIO_T35p, (PADD8), (DQ4T)/(DQ5T)/(DQ5T))
SRAM_A14: U16.30(A14) U25.C13(IO, DIFFIO_T35n, (PADD7))
SRAM_A15: U16.31(A15) U25.B13(IO, DIFFIO_T29p, (PADD12), (DQS4T/CQ5T,DPCLK9)/(DQS4T/CQ5T,DPCLK9)/(DQS4T/CQ5T,DPCLK9))
SRAM_A16: U16.32(A16) U25.A13(IO, DIFFIO_T29n, (PADD11), (DQ4T)/(DQ5T)/(DQ5T))
SRAM_CE: U16.5(CE#) U25.A10(IO, DIFFIO_T25n, (DQ5T)/(DQ3T)/(DQ5T))
SRAM_DQ0: U16.6(I/O0) U25.B10(IO, DIFFIO_T25p, (PADD15))
SRAM_DQ1: U16.7(I/O1) U25.A9(IO, DIFFIO_T24n, (PADD16), (DQ5T)/(DQ3T)/(DQ5T))
SRAM_DQ2: U16.10(I/O2) U25.B9(IO, DIFFIO_T24p, (PADD17), (DQS5T/CQ5T#,DPCLK10)/(DQS5T/CQ5T#,DPCLK10)/(DQS5T/CQ5T#,DPCLK10))
SRAM_DQ3: U16.11(I/O3) U25.C8(IO, DIFFIO_T16n, (DATA14), (DQS3T/CQ3T#,DPCLK11)/(DQS3T/CQ3T#,DPCLK11)/(DQS3T/CQ3T#,DPCLK11))
SRAM_DQ4: U16.22(I/O4) U25.A16(IO, DIFFIO_T40n, (DM2T)/(DM5T/BWS#5T)/(DM5T/BWS#5T))
SRAM_DQ5: U16.23(I/O5) U25.B15(IO, DIFFIO_T36p, (PADD6), (DQ4T)/(DQ5T)/(DQ5T))
SRAM_DQ6: U16.26(I/O6) U25.A15(IO, DIFFIO_T36n, (PADD5), (DQ4T)/(DQ5T)/(DQ5T))
SRAM_DQ7: U16.27(I/O7) U25.B14(IO, DIFFIO_T31p, (PADD10), (DQ4T)/(DQ5T)/(DQ5T))
SRAM_OE: U16.28(OE#) U25.A14(IO, DIFFIO_T31n, (PADD9), (DQ4T)/(DQ5T)/(DQ5T))
SRAM_WE: U16.12(WE#) U25.A8(IO, DIFFIO_T20n, (DATA2), (DQ5T)/(DQ3T)/(DQ5T))
UART_DTR: U25.B6(IO, DIFFIO_T18p, (DATA15), (DQ5T)/(DQ3T)/(DQ5T)) ; also on sheet 4
UART_RTS: U25.A6(IO, DIFFIO_T18n, (PADD19), (DQ5T)/(DQ3T)/(DQ5T)) ; also on sheet 4
UART_RX: U25.C6(IO, DIFFIO_T7n, (DATA7), (DQ3T)/(DQ3T)/(DQ5T)) ; also on sheet 4
UART_TX: U25.A5(IO, DIFFIO_T11p, (DATA5), (DQ3T)/(DQ3T)/(DQ5T)) ; also on sheet 4
VUSB: U9.3 U11.3 ; also on sheet 4
$1N7566: R150.1 U2.7(IO3)
$1N7568: R149.2 U2.3(IO2)
$1N7578: R119.1 X1.1(Tri-state)
$1N11731: R143.1 U25.K6(nSTATUS)
$1N16502: LED1.1(K) R140.2
$2N3832: C50.2 R28.1
$2N3905: C49.2 R27.1
$2N4177: LED2.1(K) LED3.2(A) LED4.1(K) LED5.2(A) U5.4(LED3)
$2N4211: LED4.2(A) LED5.1(K) U5.3(LED2)
$2N4217: LED2.2(A) LED3.1(K) U5.2(LED1)
$2N4336: L1.1 U5.7(SW)
$2N4396: R29.2 U5.5(KEY)
$2N4543: C172.2 R32.2 U7.1(VDD)
$2N5016: R29.1 SW3.1
$2N6182: C170.2 U3.2 U4.2(SW)
$2N6200: C170.1 U4.6(VBST)
$2N6370: R125.2 U4.5(EN)
$2N6467: R30.2 R31.1 U4.4(VFB)
$2N8469: C169.1 U8.6(VBST)
$2N8470: R126.2 U8.5(EN)
$2N8472: C169.2 U6.2 U8.2(SW)
$2N8484: R34.1 R35.1 U8.4(VFB)
$2N9042: C168.2 U12.2 U13.2(SW)
$2N9056: C168.1 U13.6(VBST)
$2N9057: R127.2 U13.5(EN)
$2N9058: R37.1 R38.1 U13.4(VFB)
$2N9656: F1.2 U11.2

Not connected (* = marked no-connect by the designer): P1 6* 7* 8*; U9 1*; U10 1*; U14 40(NC)*; U15 40(NC)*; U25 A3(IO, DIFFIO_T4n, (DATA10), (DQ3T)/(DQ3T)/(DQ5T)) A11(CLK10, DIFFCLK_4n) A12(CLK8, DIFFCLK_5n) AA8(IO, DIFFIO_B18p, (DQ5B)/(DQ3B)/(DQ5B)) AA9(IO, DIFFIO_B21p, (DQ5B)/(DQ3B)/(DQ5B)) AA10(IO, DIFFIO_B27p, (DM4B)/(DM5B/BWS#5B)/(DM5B/BWS#5B)) AA11(CLK15, DIFFCLK_6p) AA12(CLK13, DIFFCLK_7p) AA13(IO, DIFFIO_B28p, (DQ4B)/(DQ5B)/(DQ5B)) AA14(IO, DIFFIO_B29p, (DQ4B)/(DQ5B)/(DQ5B)) AA15(IO, DIFFIO_B33p, (DQ4B)/(DQ5B)/(DQ5B)) AA16(IO, DIFFIO_B35p, (DM2B)/(DM5B/BWS#5B)/(DM5B/BWS#5B)) AA17(IO, DIFFIO_B43p) AA18(IO, VREFB4N1) AA19(IO, RUP2) AB4(IO, VREFB3N2) AB7(IO, DIFFIO_B14n, (DQ5B)/(DQ3B)/(DQ5B)) AB8(IO, DIFFIO_B18n, (DQ5B)/(DQ3B)/(DQ5B)) AB9(IO, DIFFIO_B21n, (DQS5B/CQ5B#,DPCLK3)/(DQS5B/CQ5B#,DPCLK3)/(DQS5B/CQ5B#,DPCLK3)) AB10(IO, DIFFIO_B27n, (_)/(DQ5B)/(DQ5B)) AB11(CLK14, DIFFCLK_6n) AB12(CLK12, DIFFCLK_7n) AB13(IO, DIFFIO_B28n, (DQ4B)/(DQ5B)/(DQ5B)) AB14(IO, DIFFIO_B29n, (DQ4B)/(DQ5B)/(DQ5B)) AB15(IO, DIFFIO_B33n, (DQ4B)/(DQ5B)/(DQ5B)) AB16(IO, DIFFIO_B35n, (DQ2B)/(DQ5B)/(DQ5B)) AB17(IO, DIFFIO_B43n) AB18(IO, (DQ2B)/(DQ5B)/(DQ5B)) AB19(IO, RDN2) AB20(IO, DIFFIO_B49n, (DQ2B)/(DQ5B)/(DQ5B)) B5(IO, VREFB8N2) B11(CLK11, DIFFCLK_4p) B12(CLK9, DIFFCLK_5p) C10(IO, VREFB8N0) C15(IO, VREFB7N2) D2(IO, DIFFIO_L8p, (DQ2L)/(DQ1L)/(DQ1L)) D6(IO, VREFB8N3) D7(IO, DIFFIO_T7p) D15(IO, VREFB7N1) D17(IO, VREFB7N0) D20(IO, VREFB6N0) E1(IO, DIFFIO_L10n, (_)/(DQ1L)/(DQ1L)) E5(IO, PLL3_CLKOUTp) E6(IO, PLL3_CLKOUTn) E7(IO) E9(IO, VREFB8N1) E13(IO, VREFB7N3) E14(IO, DIFFIO_T38n, (PADD3), (DQ4T)/(DQ5T)/(DQ5T)) E15(IO, DIFFIO_T44n, (DQ2T)/(DQ5T)/(DQ5T)) E16(IO, DIFFIO_T51p, (DQ2T)/(DQ5T)/(DQ5T)) F7(IO, DIFFIO_T1n, (DM3T/BWS#3T)/(DM3T/BWS#3T)/(DM5T/BWS#5T)) F8(IO, DIFFIO_T5n, (DATA9), (DQ3T)/(DQ3T)/(DQ5T)) F9(IO) F10(IO, DIFFIO_T8p, (DATA6), (DQ3T)/(DQ3T)/(DQ5T)) F11(IO, DIFFIO_T27p, (PADD14), (DM4T)/(DM5T/BWS#5T)/(DM5T/BWS#5T)) F13(IO, DIFFIO_T37p, (PADD4), (DQS2T/CQ3T,DPCLK8)/(DQS2T/CQ3T,DPCLK8)/(DQS2T/CQ3T,DPCLK8))* F14(IO, DIFFIO_T49p, (DQS0T/CQ1T,CDPCLK6)/(DQS0T/CQ1T,CDPCLK6)/(DQS0T/CQ1T,CDPCLK6)) F15(IO, DIFFIO_T50n, (DQ2T)/(DQ5T)/(DQ5T)) F16(IO, DIFFIO_T51n) F17(IO, DIFFIO_R2n, (DQ2R)/(DQ1R)/(DQ1R)) G1(CLK1, DIFFCLK_0n) G5(IO, VREFB1N0) G7(IO, DIFFIO_T1p) G8(IO, DIFFIO_T5p) G9(IO) G10(IO, DIFFIO_T8n) G11(IO, DIFFIO_T22n) G13(IO, DIFFIO_T42n) G14(IO, DIFFIO_T44p) G15(IO, DIFFIO_T49n) G16(IO, DIFFIO_T50p) G17(IO, DIFFIO_R2p) G18(IO, DIFFIO_R7n, (PADD23), (DQ2R)/(DQ1R)/(DQ1R)) G21(CLK4, DIFFCLK_2p) G22(CLK5, DIFFCLK_2n) H5(IO, VREFB1N2) H6(IO, DIFFIO_L9p, (DQ2L)/(DQ1L)/(DQ1L)) H7(IO, VREFB1N1) H8(IO, DIFFIO_L14p) H10(IO, DIFFIO_T14p) H11(IO, DIFFIO_T14n) H14(IO, DIFFIO_T48p) H15(IO, DIFFIO_T48n) H16(IO, DIFFIO_R10p) H17(IO, DIFFIO_R7p) H18(IO, VREFB6N1) J3(IO, VREFB1N3) J5(IO, DIFFIO_L18n) J6(IO, DIFFIO_L9n, (DQ2L)/(DQ1L)/(DQ1L)) J7(IO, DIFFIO_L21p) J8(IO, DIFFIO_L14n) J17(IO, DIFFIO_R10n) J18(IO, VREFB6N2) K7(IO, DIFFIO_L21n) K8(IO, DIFFIO_L20n) K17(IO, DIFFIO_R20n) K19(IO, VREFB6N3) K22(IO, DIFFIO_R24n, (nCEO)) L6(IO, DIFFIO_L26p, (DQ0L)/(DQ1L)/(DQ1L)) L7(IO, DIFFIO_L30n) L8(IO, DIFFIO_L20p) M5(IO, VREFB2N0) M6(IO, DIFFIO_L26n, (DQ0L)/(DQ1L)/(DQ1L)) M7(IO, DIFFIO_L41n) M8(IO, DIFFIO_L42p) M16(IO, VREFB5N0) N7(IO, DIFFIO_L49p) N8(IO, DIFFIO_L42n) N16(IO, DIFFIO_R40p) N17(IO, DIFFIO_R33n) N18(IO, DIFFIO_R33p, (DQS1R/CQ1R#,DPCLK6)/(DQS1R/CQ1R#,DPCLK6)/(DQS1R/CQ1R#,DPCLK6)) P5(IO, VREFB2N1) P7(IO, DIFFIO_L49n) P15(IO, DIFFIO_R46n) P16(IO, DIFFIO_R46p) P17(IO) P20(IO, VREFB5N1) R5(IO, VREFB2N3) R6(IO) R7(IO, DIFFIO_L53p) R14(IO, DIFFIO_B52p) R15(IO, DIFFIO_B52n) R16(IO, PLL4_CLKOUTn) R17(IO, VREFB5N2) R18(IO, DIFFIO_R42n) T1(CLK3, DIFFCLK_1n) T3(IO, VREFB2N2) T7(IO, DIFFIO_L53n) T8(IO, DIFFIO_B11p) T9(IO, DIFFIO_B11n) T10(IO, DIFFIO_B15p) T11(IO, DIFFIO_B15n) T12(IO, DIFFIO_B36p) T13(IO, DIFFIO_B36n) T14(IO, DIFFIO_B42p) T15(IO, DIFFIO_B42n, (DQ2B)/(DQ5B)/(DQ5B)) T16(IO, PLL4_CLKOUTp) T17(IO, RUP3) T18(IO, RDN3) T21(CLK6, DIFFCLK_3p) T22(CLK7, DIFFCLK_3n) U7(IO, DIFFIO_B3p) U8(IO, DIFFIO_B3n) U9(IO, DIFFIO_B13p, (DQ3B)/(DQ3B)/(DQ5B)) U10(IO, DIFFIO_B17n, (DQ5B)/(DQ3B)/(DQ5B)) U11(IO, VREFB3N0) U12(IO, DIFFIO_B34p, (DQ4B)/(DQ5B)/(DQ5B)) U13(IO, DIFFIO_B38n) U14(IO, DIFFIO_B39n) U15(IO, DIFFIO_B40p) U16(IO, DIFFIO_B50p) U17(IO, DIFFIO_B50n) V5(IO, DIFFIO_B1n, (DM3B/BWS#3B)/(DM3B/BWS#3B)/(DM5B/BWS#5B)) V6(IO, DIFFIO_B1p) V7(IO, DIFFIO_B7n) V8(IO, DIFFIO_B13n, (DQ3B)/(DQ3B)/(DQ5B)) V9(IO, VREFB3N1) V10(IO, DIFFIO_B16p, (DQS3B/CQ3B#,DPCLK2)/(DQS3B/CQ3B#,DPCLK2)/(DQS3B/CQ3B#,DPCLK2)) V11(IO, DIFFIO_B25n, (DQ5B)/(DQ3B)/(DQ5B)) V12(IO, VREFB4N3) V13(IO, (DQS2B/CQ3B,DPCLK5)/(DQS2B/CQ3B,DPCLK5)/(DQS2B/CQ3B,DPCLK5)) V14(IO, DIFFIO_B39p, (DQ2B)/(DQ5B)/(DQ5B)) V15(IO, DIFFIO_B40n, (DQ2B)/(DQ5B)/(DQ5B)) V16(IO, VREFB4N0) W8(IO, (DQ3B)/(DQ3B)/(DQ5B)) W10(IO, DIFFIO_B26p, (DQ5B)/(DQ3B)/(DQ5B)) W13(IO, DIFFIO_B32p, (DQ4B)/(DQ5B)/(DQ5B)) W14(IO, VREFB4N2) W15(IO, DIFFIO_B41n, (DQ2B)/(DQ5B)/(DQ5B)) W17(IO, DIFFIO_B48p, (DQ2B)/(DQ5B)/(DQ5B)) W19(IO, VREFB5N3) Y4(IO, VREFB3N3) Y8(IO, (DQ5B)/(DQ3B)/(DQ5B)) Y10(IO, DIFFIO_B26n, (DQ5B)/(DQ3B)/(DQ5B)) Y13(IO, DIFFIO_B32n, (DQS4B/CQ5B,DPCLK4)/(DQS4B/CQ5B,DPCLK4)/(DQS4B/CQ5B,DPCLK4)) Y17(IO, DIFFIO_B48n, (DQS0B/CQ1B,CDPCLK3)/(DQS0B/CQ1B,CDPCLK3)/(DQS0B/CQ1B,CDPCLK3))

## Notes on the sheets
sheet 1
- POWER
- CONFIG
- TODO: only 10nF on 3V3 and one 10uF, use smaller package
- CLOCK
- TODO: one clk pair to header
sheet 2
- BUCK 3V3
- CHARGE/BOOST
- 0.768 * (1 + 33/10) = 3.3024
- BUCK 2V5
- BMS
- BATTERY
- POWER SELECT
- FAN HEADER
- 0.768 * (1 + 75/33) = 2.5134
- BUCK 1V2
- CHARGE
- ON/OFF
- USB/BAT
- 0.768 * (1 + 56/100) = 1.198
sheet 3
- SDRAM
- SRAM
